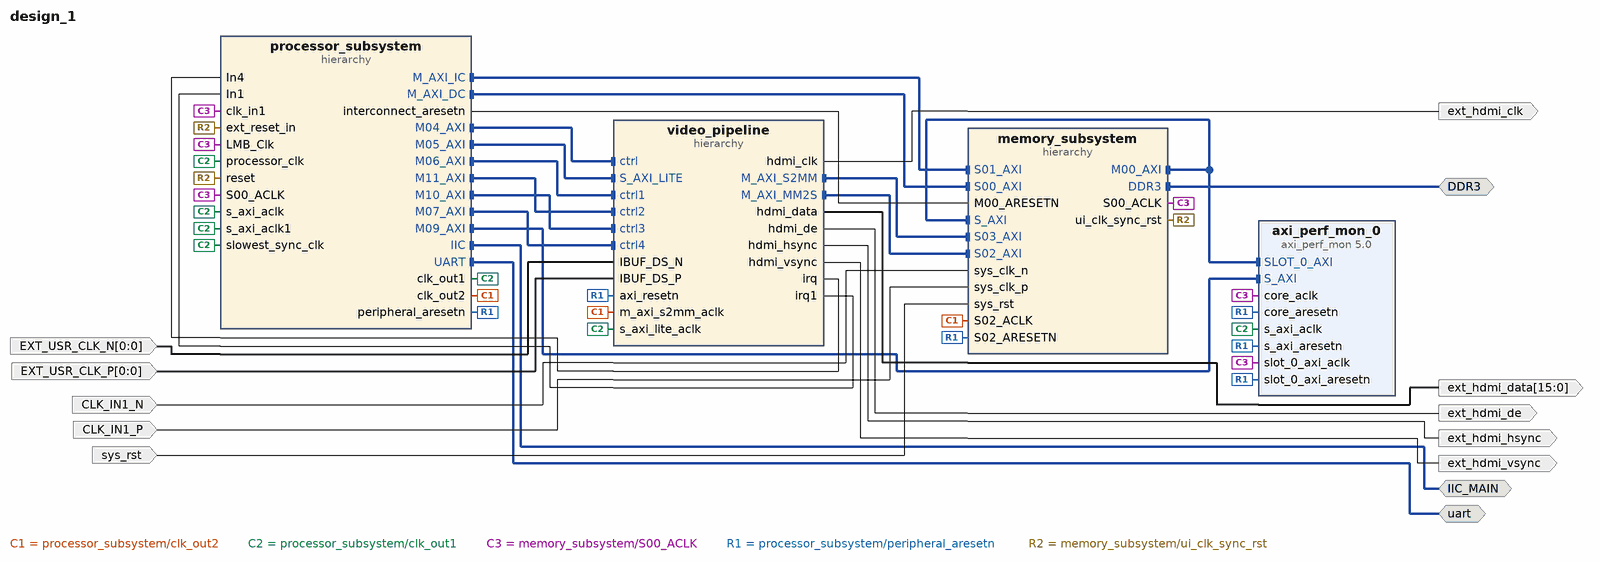
[diagram p0: block diagram of the top level]
# Vivado block design design_1, Vivado 2014.2
create_bd_design design_1

create_bd_intf_port -mode Master -vlnv xilinx.com:interface:ddrx_rtl:1.0 DDR3
create_bd_intf_port -mode Master -vlnv xilinx.com:interface:iic_rtl:1.0 IIC_MAIN
create_bd_intf_port -mode Master -vlnv xilinx.com:interface:uart_rtl:1.0 uart
create_bd_port -dir O ext_hdmi_clk
create_bd_port -dir O -from 15 -to 0 ext_hdmi_data
create_bd_port -dir O ext_hdmi_de
create_bd_port -dir O ext_hdmi_hsync
create_bd_port -dir O ext_hdmi_vsync
create_bd_port -dir I -from 0 -to 0 EXT_USR_CLK_N
create_bd_port -dir I -from 0 -to 0 EXT_USR_CLK_P
create_bd_port -dir I -type clk CLK_IN1_N
create_bd_port -dir I -type clk CLK_IN1_P
create_bd_port -dir I -type rst sys_rst
set_property -dict {CONFIG.POLARITY ACTIVE_HIGH} [get_bd_ports sys_rst]

create_bd_cell -type hier processor_subsystem
create_bd_cell -type hier video_pipeline
create_bd_cell -type hier memory_subsystem
create_bd_cell -type ip -vlnv xilinx.com:ip:axi_perf_mon:5.0 axi_perf_mon_0
set_property -dict {CONFIG.C_NUM_OF_COUNTERS 6} [get_bd_cells axi_perf_mon_0]

# ---- hierarchy /processor_subsystem ----
current_bd_instance /processor_subsystem
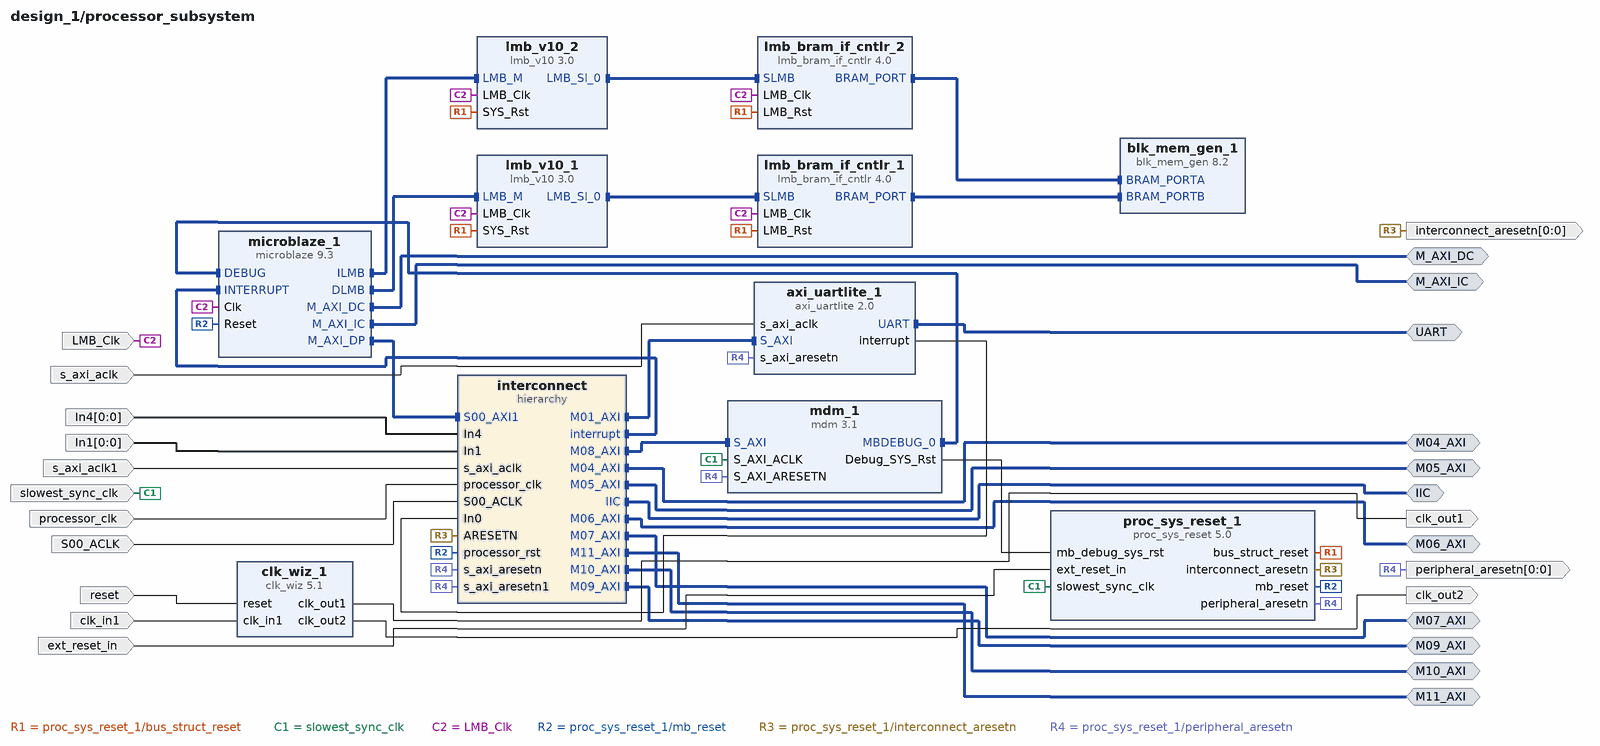
[diagram p1: block diagram inside /processor_subsystem]
create_bd_intf_pin -mode Master -vlnv xilinx.com:interface:aximm_rtl:1.0 M_AXI_DC
create_bd_intf_pin -mode Master -vlnv xilinx.com:interface:aximm_rtl:1.0 M_AXI_IC
create_bd_intf_pin -mode Master -vlnv xilinx.com:interface:uart_rtl:1.0 UART
create_bd_intf_pin -mode Master -vlnv xilinx.com:interface:aximm_rtl:1.0 M04_AXI
create_bd_intf_pin -mode Master -vlnv xilinx.com:interface:aximm_rtl:1.0 M05_AXI
create_bd_intf_pin -mode Master -vlnv xilinx.com:interface:aximm_rtl:1.0 M06_AXI
create_bd_intf_pin -mode Master -vlnv xilinx.com:interface:aximm_rtl:1.0 M11_AXI
create_bd_intf_pin -mode Master -vlnv xilinx.com:interface:aximm_rtl:1.0 M10_AXI
create_bd_intf_pin -mode Master -vlnv xilinx.com:interface:aximm_rtl:1.0 M07_AXI
create_bd_intf_pin -mode Master -vlnv xilinx.com:interface:aximm_rtl:1.0 M09_AXI
create_bd_intf_pin -mode Master -vlnv xilinx.com:interface:iic_rtl:1.0 IIC
create_bd_pin -dir I -type clk slowest_sync_clk
create_bd_pin -dir I -type clk LMB_Clk
create_bd_pin -dir I -type rst ext_reset_in
create_bd_pin -dir O -from 0 -to 0 -type rst interconnect_aresetn
create_bd_pin -dir O -from 0 -to 0 -type rst peripheral_aresetn
create_bd_pin -dir I s_axi_aclk
create_bd_pin -dir I -from 0 -to 0 In4
create_bd_pin -dir I -from 0 -to 0 In1
create_bd_pin -dir I s_axi_aclk1
create_bd_pin -dir I processor_clk
create_bd_pin -dir I S00_ACLK
create_bd_pin -dir I reset
create_bd_pin -dir I clk_in1
create_bd_pin -dir O clk_out1
create_bd_pin -dir O clk_out2

create_bd_cell -type hier interconnect
create_bd_cell -type ip -vlnv xilinx.com:ip:lmb_v10:3.0 lmb_v10_2
create_bd_cell -type ip -vlnv xilinx.com:ip:lmb_bram_if_cntlr:4.0 lmb_bram_if_cntlr_1
set_property -dict {CONFIG.C_MASK 0xc0000000} [get_bd_cells lmb_bram_if_cntlr_1]
create_bd_cell -type ip -vlnv xilinx.com:ip:lmb_v10:3.0 lmb_v10_1
create_bd_cell -type ip -vlnv xilinx.com:ip:blk_mem_gen:8.2 blk_mem_gen_1
set_property -dict [list \
  CONFIG.Memory_Type True_Dual_Port_RAM \
  CONFIG.Enable_B Use_ENB_Pin \
  CONFIG.Use_RSTB_Pin true \
  CONFIG.Port_B_Clock 100 \
  CONFIG.Port_B_Write_Rate 50 \
  CONFIG.Port_B_Enable_Rate 100 \
  CONFIG.use_bram_block BRAM_Controller \
  CONFIG.MEM_FILE design_1_blk_mem_gen_1_0.mem \
] [get_bd_cells blk_mem_gen_1]
create_bd_cell -type ip -vlnv xilinx.com:ip:microblaze:9.3 microblaze_1
set_property -dict [list \
  CONFIG.C_FREQ 100000000 \
  CONFIG.C_D_AXI 1 \
  CONFIG.C_M_AXI_DC_USER_SIGNALS 0 \
  CONFIG.C_M_AXI_IC_USER_SIGNALS 0 \
  CONFIG.C_USE_MSR_INSTR 1 \
  CONFIG.C_USE_PCMP_INSTR 1 \
  CONFIG.C_USE_BARREL 1 \
  CONFIG.C_USE_HW_MUL 1 \
  CONFIG.C_ICACHE_BASEADDR 0x80000000 \
  CONFIG.C_ICACHE_HIGHADDR 0xFFFFFFFF \
  CONFIG.C_USE_ICACHE 1 \
  CONFIG.C_CACHE_BYTE_SIZE 16384 \
  CONFIG.C_ICACHE_ALWAYS_USED 1 \
  CONFIG.C_DCACHE_BASEADDR 0x80000000 \
  CONFIG.C_DCACHE_HIGHADDR 0xFFFFFFFF \
  CONFIG.C_USE_DCACHE 1 \
  CONFIG.C_DCACHE_BYTE_SIZE 16384 \
  CONFIG.C_DCACHE_ALWAYS_USED 1 \
  CONFIG.C_USE_INTERRUPT 2 \
  CONFIG.C_USE_EXT_BRK 0 \
  CONFIG.C_USE_EXT_NM_BRK 0 \
] [get_bd_cells microblaze_1]
create_bd_cell -type ip -vlnv xilinx.com:ip:clk_wiz:5.1 clk_wiz_1
set_property -dict [list \
  CONFIG.CLKOUT2_USED true \
  CONFIG.CLKOUT3_USED true \
  CONFIG.CLKOUT4_USED true \
  CONFIG.NUM_OUT_CLKS 4 \
  CONFIG.CLKOUT1_REQUESTED_OUT_FREQ 50.000 \
  CONFIG.CLKOUT2_REQUESTED_OUT_FREQ 200.000 \
  CONFIG.CLKOUT3_REQUESTED_OUT_FREQ 150.000 \
  CONFIG.CLKOUT4_REQUESTED_OUT_FREQ 100.000 \
  CONFIG.USE_LOCKED false \
  CONFIG.CLKOUT1_JITTER 132.683 \
  CONFIG.CLKOUT1_PHASE_ERROR 87.180 \
  CONFIG.CLKOUT2_JITTER 102.086 \
  CONFIG.CLKOUT2_PHASE_ERROR 87.180 \
  CONFIG.CLKOUT3_JITTER 107.567 \
  CONFIG.CLKOUT3_PHASE_ERROR 87.180 \
  CONFIG.CLKOUT4_JITTER 115.831 \
  CONFIG.CLKOUT4_PHASE_ERROR 87.180 \
] [get_bd_cells clk_wiz_1]
create_bd_cell -type ip -vlnv xilinx.com:ip:axi_uartlite:2.0 axi_uartlite_1
set_property -dict {CONFIG.C_S_AXI_ACLK_FREQ_HZ 50000000} [get_bd_cells axi_uartlite_1]
create_bd_cell -type ip -vlnv xilinx.com:ip:proc_sys_reset:5.0 proc_sys_reset_1
set_property -dict {CONFIG.C_AUX_RESET_HIGH 0} [get_bd_cells proc_sys_reset_1]
create_bd_cell -type ip -vlnv xilinx.com:ip:mdm:3.1 mdm_1
set_property -dict {CONFIG.C_USE_UART 1} [get_bd_cells mdm_1]
create_bd_cell -type ip -vlnv xilinx.com:ip:lmb_bram_if_cntlr:4.0 lmb_bram_if_cntlr_2
set_property -dict {CONFIG.C_MASK 0x80000000} [get_bd_cells lmb_bram_if_cntlr_2]

# ---- hierarchy /processor_subsystem/interconnect ----
current_bd_instance /processor_subsystem/interconnect
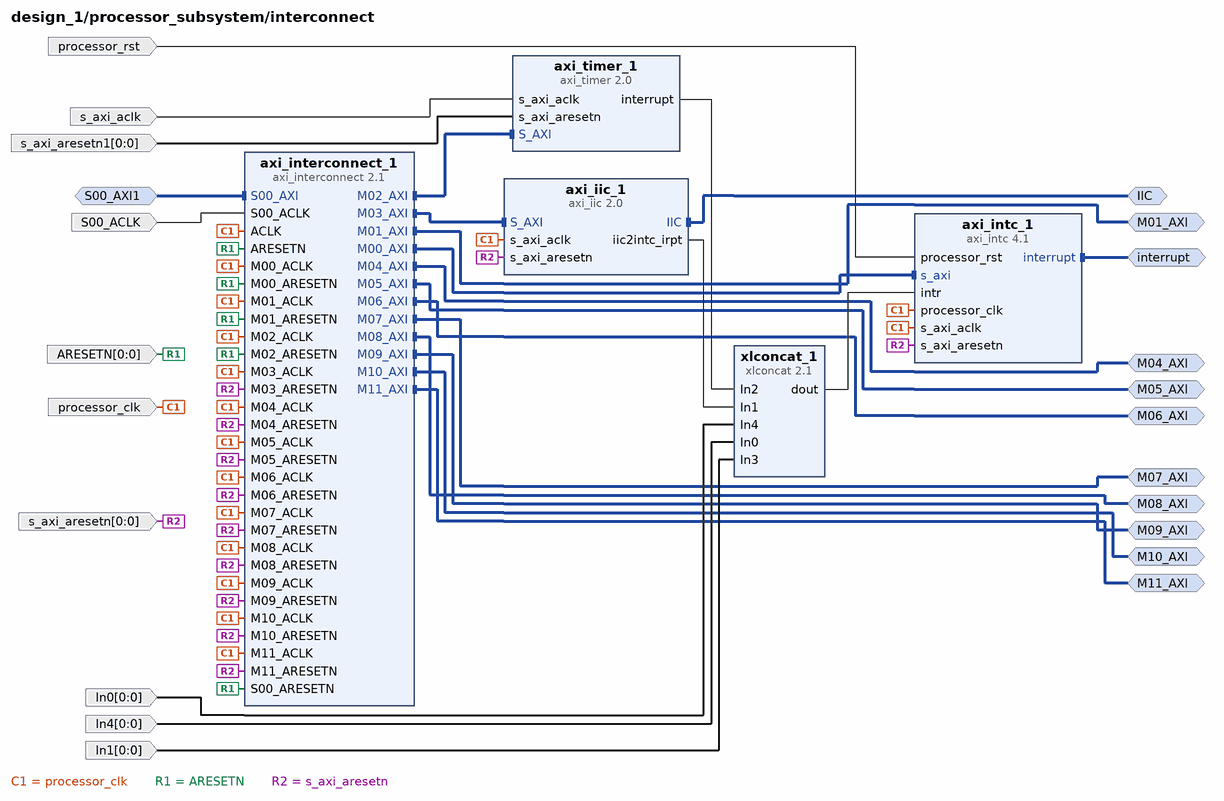
[diagram p2: block diagram inside /processor_subsystem/interconnect]
create_bd_intf_pin -mode Master -vlnv xilinx.com:interface:iic_rtl:1.0 IIC
create_bd_intf_pin -mode Master -vlnv xilinx.com:interface:mbinterrupt_rtl:1.0 interrupt
create_bd_intf_pin -mode Slave -vlnv xilinx.com:interface:aximm_rtl:1.0 S00_AXI1
create_bd_intf_pin -mode Master -vlnv xilinx.com:interface:aximm_rtl:1.0 M01_AXI
create_bd_intf_pin -mode Master -vlnv xilinx.com:interface:aximm_rtl:1.0 M04_AXI
create_bd_intf_pin -mode Master -vlnv xilinx.com:interface:aximm_rtl:1.0 M05_AXI
create_bd_intf_pin -mode Master -vlnv xilinx.com:interface:aximm_rtl:1.0 M06_AXI
create_bd_intf_pin -mode Master -vlnv xilinx.com:interface:aximm_rtl:1.0 M07_AXI
create_bd_intf_pin -mode Master -vlnv xilinx.com:interface:aximm_rtl:1.0 M08_AXI
create_bd_intf_pin -mode Master -vlnv xilinx.com:interface:aximm_rtl:1.0 M09_AXI
create_bd_intf_pin -mode Master -vlnv xilinx.com:interface:aximm_rtl:1.0 M10_AXI
create_bd_intf_pin -mode Master -vlnv xilinx.com:interface:aximm_rtl:1.0 M11_AXI
create_bd_pin -dir I -type clk processor_clk
create_bd_pin -dir I -type clk S00_ACLK
create_bd_pin -dir I -type rst processor_rst
create_bd_pin -dir I -from 0 -to 0 -type rst ARESETN
create_bd_pin -dir I -from 0 -to 0 -type rst s_axi_aresetn
create_bd_pin -dir I -from 0 -to 0 In0
create_bd_pin -dir I -from 0 -to 0 In4
create_bd_pin -dir I -from 0 -to 0 In1
create_bd_pin -dir I s_axi_aclk
create_bd_pin -dir I -from 0 -to 0 s_axi_aresetn1

create_bd_cell -type ip -vlnv xilinx.com:ip:axi_timer:2.0 axi_timer_1
create_bd_cell -type ip -vlnv xilinx.com:ip:axi_intc:4.1 axi_intc_1
set_property -dict [list \
  CONFIG.C_KIND_OF_INTR 0xFFFFFFF0 \
  CONFIG.C_ASYNC_INTR 0xFFFFFFE9 \
  CONFIG.C_HAS_FAST 1 \
  CONFIG.C_DISABLE_SYNCHRONIZERS 1 \
] [get_bd_cells axi_intc_1]
create_bd_cell -type ip -vlnv xilinx.com:ip:axi_interconnect:2.1 axi_interconnect_1
set_property -dict {CONFIG.NUM_MI 12} [get_bd_cells axi_interconnect_1]
create_bd_cell -type ip -vlnv xilinx.com:ip:axi_iic:2.0 axi_iic_1
set_property -dict {CONFIG.C_GPO_WIDTH 3 CONFIG.USE_BOARD_FLOW true CONFIG.IIC_BOARD_INTERFACE iic_main} [get_bd_cells axi_iic_1]
create_bd_cell -type ip -vlnv xilinx.com:ip:xlconcat:2.1 xlconcat_1
set_property -dict {CONFIG.NUM_PORTS 5} [get_bd_cells xlconcat_1]

# ---- hierarchy /video_pipeline ----
current_bd_instance /video_pipeline
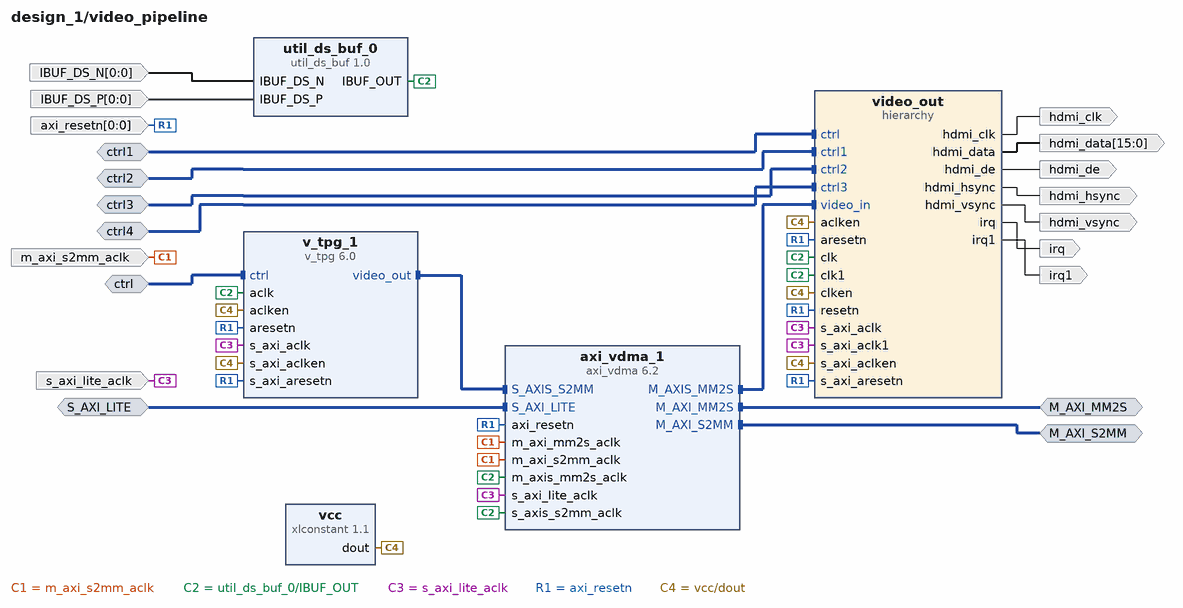
[diagram p3: block diagram inside /video_pipeline]
create_bd_intf_pin -mode Slave -vlnv xilinx.com:interface:aximm_rtl:1.0 ctrl
create_bd_intf_pin -mode Slave -vlnv xilinx.com:interface:aximm_rtl:1.0 S_AXI_LITE
create_bd_intf_pin -mode Master -vlnv xilinx.com:interface:aximm_rtl:1.0 M_AXI_MM2S
create_bd_intf_pin -mode Master -vlnv xilinx.com:interface:aximm_rtl:1.0 M_AXI_S2MM
create_bd_intf_pin -mode Slave -vlnv xilinx.com:interface:aximm_rtl:1.0 ctrl1
create_bd_intf_pin -mode Slave -vlnv xilinx.com:interface:aximm_rtl:1.0 ctrl2
create_bd_intf_pin -mode Slave -vlnv xilinx.com:interface:aximm_rtl:1.0 ctrl3
create_bd_intf_pin -mode Slave -vlnv xilinx.com:interface:aximm_rtl:1.0 ctrl4
create_bd_pin -dir O -type intr irq
create_bd_pin -dir O irq1
create_bd_pin -dir I -type clk m_axi_s2mm_aclk
create_bd_pin -dir O hdmi_clk
create_bd_pin -dir O -from 15 -to 0 hdmi_data
create_bd_pin -dir O hdmi_de
create_bd_pin -dir O hdmi_hsync
create_bd_pin -dir O hdmi_vsync
create_bd_pin -dir I -type clk s_axi_lite_aclk
create_bd_pin -dir I -from 0 -to 0 -type rst axi_resetn
create_bd_pin -dir I -from 0 -to 0 IBUF_DS_N
create_bd_pin -dir I -from 0 -to 0 IBUF_DS_P

create_bd_cell -type hier video_out
create_bd_cell -type ip -vlnv xilinx.com:ip:axi_vdma:6.2 axi_vdma_1
set_property -dict [list \
  CONFIG.c_m_axi_mm2s_data_width 32 \
  CONFIG.c_m_axis_mm2s_tdata_width 24 \
  CONFIG.c_m_axi_s2mm_data_width 32 \
  CONFIG.c_use_mm2s_fsync 0 \
  CONFIG.c_use_s2mm_fsync 0 \
  CONFIG.c_mm2s_genlock_mode 3 \
  CONFIG.c_s2mm_genlock_mode 2 \
  CONFIG.c_mm2s_linebuffer_depth 1024 \
  CONFIG.c_s2mm_linebuffer_depth 1024 \
  CONFIG.c_mm2s_max_burst_length 256 \
  CONFIG.c_s2mm_max_burst_length 256 \
  CONFIG.c_enable_debug_info_6 0 \
  CONFIG.c_enable_debug_info_7 0 \
  CONFIG.c_enable_debug_info_14 0 \
  CONFIG.c_enable_debug_info_15 0 \
] [get_bd_cells axi_vdma_1]
create_bd_cell -type ip -vlnv xilinx.com:ip:v_tpg:6.0 v_tpg_1
set_property -dict {CONFIG.has_axi4s_slave false CONFIG.pattern_control 11 CONFIG.m_video_format 2} [get_bd_cells v_tpg_1]
create_bd_cell -type ip -vlnv xilinx.com:ip:xlconstant:1.1 vcc
create_bd_cell -type ip -vlnv xilinx.com:ip:util_ds_buf:1.0 util_ds_buf_0

# ---- hierarchy /video_pipeline/video_out ----
current_bd_instance /video_pipeline/video_out
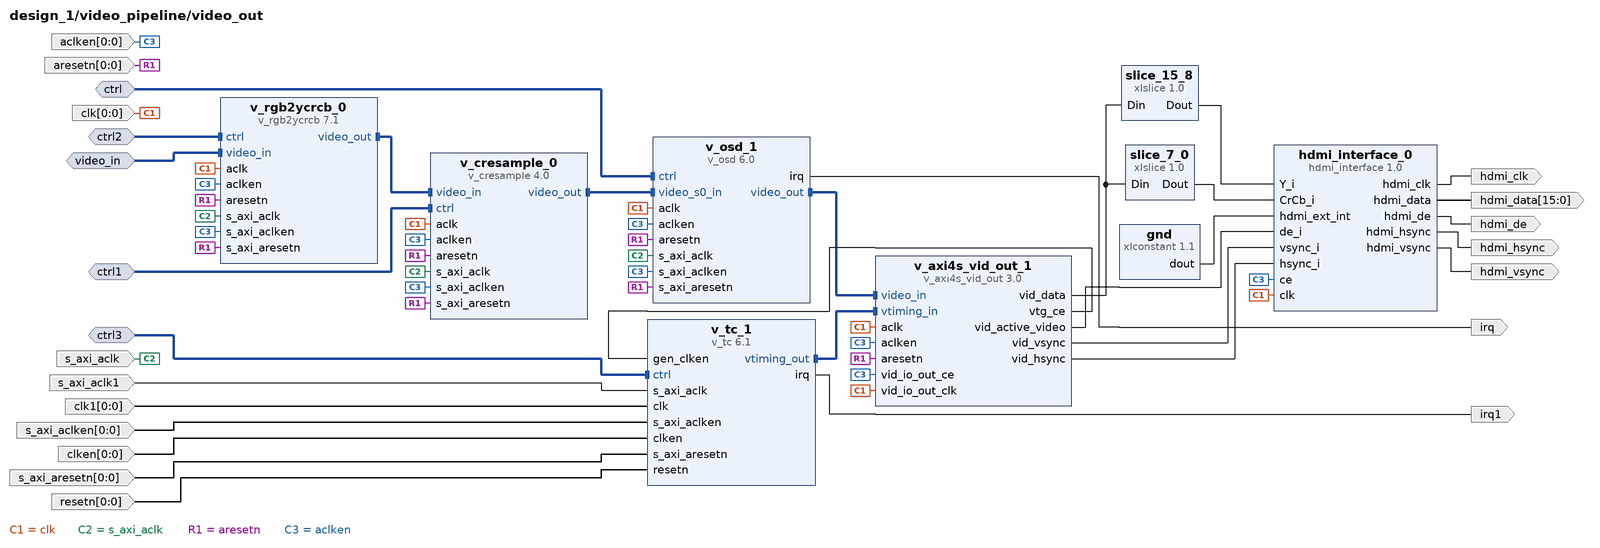
[diagram p4: block diagram inside /video_pipeline/video_out]
create_bd_intf_pin -mode Slave -vlnv xilinx.com:interface:aximm_rtl:1.0 ctrl
create_bd_intf_pin -mode Slave -vlnv xilinx.com:interface:aximm_rtl:1.0 ctrl1
create_bd_intf_pin -mode Slave -vlnv xilinx.com:interface:aximm_rtl:1.0 ctrl2
create_bd_intf_pin -mode Slave -vlnv xilinx.com:interface:axis_rtl:1.0 video_in
create_bd_intf_pin -mode Slave -vlnv xilinx.com:interface:aximm_rtl:1.0 ctrl3
create_bd_pin -dir I -from 0 -to 0 clk
create_bd_pin -dir O hdmi_clk
create_bd_pin -dir O -from 15 -to 0 hdmi_data
create_bd_pin -dir O hdmi_de
create_bd_pin -dir O hdmi_hsync
create_bd_pin -dir O hdmi_vsync
create_bd_pin -dir I -type clk s_axi_aclk
create_bd_pin -dir I -from 0 -to 0 -type rst aresetn
create_bd_pin -dir I -from 0 -to 0 -type ce aclken
create_bd_pin -dir O -type intr irq
create_bd_pin -dir I s_axi_aclk1
create_bd_pin -dir I -from 0 -to 0 clk1
create_bd_pin -dir O irq1
create_bd_pin -dir I -from 0 -to 0 s_axi_aclken
create_bd_pin -dir I -from 0 -to 0 clken
create_bd_pin -dir I -from 0 -to 0 s_axi_aresetn
create_bd_pin -dir I -from 0 -to 0 resetn

create_bd_cell -type ip -vlnv xilinx.com:ip:xlslice:1.0 slice_15_8
set_property -dict {CONFIG.DIN_TO 8 CONFIG.DIN_FROM 15 CONFIG.DIN_WIDTH 16} [get_bd_cells slice_15_8]
create_bd_cell -type ip -vlnv xilinx.com:ip:hdmi_interface:1.0 hdmi_interface_0
create_bd_cell -type ip -vlnv xilinx.com:ip:xlslice:1.0 slice_7_0
set_property -dict {CONFIG.DIN_FROM 7 CONFIG.DIN_WIDTH 16} [get_bd_cells slice_7_0]
create_bd_cell -type ip -vlnv xilinx.com:ip:v_tc:6.1 v_tc_1
set_property -dict [list \
  CONFIG.HAS_INTC_IF false \
  CONFIG.max_clocks_per_line 8192 \
  CONFIG.max_lines_per_frame 8192 \
  CONFIG.VIDEO_MODE 1080p \
  CONFIG.horizontal_sync_generation true \
  CONFIG.enable_detection false \
  CONFIG.vertical_blank_generation true \
  CONFIG.enable_generation true \
  CONFIG.vertical_sync_generation true \
  CONFIG.active_chroma_generation false \
  CONFIG.active_video_generation true \
  CONFIG.horizontal_blank_generation true \
] [get_bd_cells v_tc_1]
create_bd_cell -type ip -vlnv xilinx.com:ip:v_axi4s_vid_out:3.0 v_axi4s_vid_out_1
set_property -dict [list \
  CONFIG.C_S_AXIS_VIDEO_FORMAT 0 \
  CONFIG.RAM_ADDR_BITS 13 \
  CONFIG.HYSTERESIS_LEVEL 12 \
  CONFIG.VTG_MASTER_SLAVE 0 \
] [get_bd_cells v_axi4s_vid_out_1]
create_bd_cell -type ip -vlnv xilinx.com:ip:v_cresample:4.0 v_cresample_0
set_property -dict [list \
  CONFIG.has_axi4_lite true \
  CONFIG.s_axis_video_format 3 \
  CONFIG.m_axis_video_format 2 \
] [get_bd_cells v_cresample_0]
create_bd_cell -type ip -vlnv xilinx.com:ip:v_osd:6.0 v_osd_1
set_property -dict [list \
  CONFIG.SCREEN_WIDTH 1920 \
  CONFIG.M_AXIS_VIDEO_WIDTH 1920 \
  CONFIG.M_AXIS_VIDEO_HEIGHT 1080 \
  CONFIG.LAYER0_WIDTH 1920 \
  CONFIG.LAYER0_HEIGHT 1080 \
] [get_bd_cells v_osd_1]
create_bd_cell -type ip -vlnv xilinx.com:ip:v_rgb2ycrcb:7.1 v_rgb2ycrcb_0
set_property -dict {CONFIG.HAS_AXI4_LITE true} [get_bd_cells v_rgb2ycrcb_0]
create_bd_cell -type ip -vlnv xilinx.com:ip:xlconstant:1.1 gnd
set_property -dict {CONFIG.CONST_VAL 0} [get_bd_cells gnd]

# ---- hierarchy /memory_subsystem ----
current_bd_instance /memory_subsystem
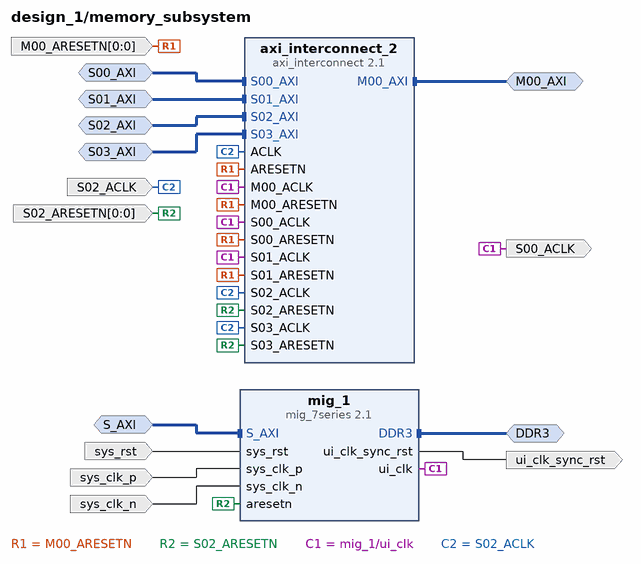
[diagram p5: block diagram inside /memory_subsystem]
create_bd_intf_pin -mode Master -vlnv xilinx.com:interface:ddrx_rtl:1.0 DDR3
create_bd_intf_pin -mode Master -vlnv xilinx.com:interface:aximm_rtl:1.0 M00_AXI
create_bd_intf_pin -mode Slave -vlnv xilinx.com:interface:aximm_rtl:1.0 S_AXI
create_bd_intf_pin -mode Slave -vlnv xilinx.com:interface:aximm_rtl:1.0 S00_AXI
create_bd_intf_pin -mode Slave -vlnv xilinx.com:interface:aximm_rtl:1.0 S01_AXI
create_bd_intf_pin -mode Slave -vlnv xilinx.com:interface:aximm_rtl:1.0 S02_AXI
create_bd_intf_pin -mode Slave -vlnv xilinx.com:interface:aximm_rtl:1.0 S03_AXI
create_bd_pin -dir I -from 0 -to 0 -type rst M00_ARESETN
create_bd_pin -dir I -from 0 -to 0 -type rst S02_ARESETN
create_bd_pin -dir O -type clk S00_ACLK
create_bd_pin -dir I -type clk S02_ACLK
create_bd_pin -dir I -type rst sys_rst
create_bd_pin -dir O -type rst ui_clk_sync_rst
create_bd_pin -dir I sys_clk_p
create_bd_pin -dir I sys_clk_n

create_bd_cell -type ip -vlnv xilinx.com:ip:axi_interconnect:2.1 axi_interconnect_2
set_property -dict [list \
  CONFIG.NUM_SI 4 \
  CONFIG.NUM_MI 1 \
  CONFIG.STRATEGY 2 \
  CONFIG.ENABLE_ADVANCED_OPTIONS 1 \
  CONFIG.XBAR_DATA_WIDTH 512 \
  CONFIG.M00_HAS_REGSLICE 1 \
  CONFIG.M00_HAS_DATA_FIFO 2 \
  CONFIG.M02_HAS_DATA_FIFO 2 \
  CONFIG.S00_HAS_REGSLICE 1 \
  CONFIG.S01_HAS_REGSLICE 1 \
  CONFIG.S02_HAS_REGSLICE 1 \
  CONFIG.S03_HAS_REGSLICE 1 \
] [get_bd_cells axi_interconnect_2]
create_bd_cell -type ip -vlnv xilinx.com:ip:mig_7series:2.1 mig_1
set_property -dict {CONFIG.XML_INPUT_FILE mig_a.prj CONFIG.RESET_BOARD_INTERFACE Custom} [get_bd_cells mig_1]

# ---- connections ----

current_bd_instance /processor_subsystem
connect_bd_intf_net [get_bd_intf_pins lmb_bram_if_cntlr_1/SLMB] [get_bd_intf_pins lmb_v10_1/LMB_Sl_0]
connect_bd_intf_net [get_bd_intf_pins blk_mem_gen_1/BRAM_PORTB] [get_bd_intf_pins lmb_bram_if_cntlr_1/BRAM_PORT]
connect_bd_intf_net [get_bd_intf_pins lmb_bram_if_cntlr_2/SLMB] [get_bd_intf_pins lmb_v10_2/LMB_Sl_0]
connect_bd_intf_net [get_bd_intf_pins blk_mem_gen_1/BRAM_PORTA] [get_bd_intf_pins lmb_bram_if_cntlr_2/BRAM_PORT]
connect_bd_intf_net [get_bd_intf_pins lmb_v10_2/LMB_M] [get_bd_intf_pins microblaze_1/ILMB]
connect_bd_intf_net [get_bd_intf_pins mdm_1/MBDEBUG_0] [get_bd_intf_pins microblaze_1/DEBUG]
connect_bd_intf_net [get_bd_intf_pins lmb_v10_1/LMB_M] [get_bd_intf_pins microblaze_1/DLMB]
connect_bd_intf_net [get_bd_intf_pins axi_uartlite_1/S_AXI] [get_bd_intf_pins interconnect/M01_AXI]
connect_bd_intf_net [get_bd_intf_pins mdm_1/S_AXI] [get_bd_intf_pins interconnect/M08_AXI]
connect_bd_intf_net [get_bd_intf_pins microblaze_1/M_AXI_DP] [get_bd_intf_pins interconnect/S00_AXI1]
connect_bd_intf_net [get_bd_intf_pins microblaze_1/INTERRUPT] [get_bd_intf_pins interconnect/interrupt]
connect_bd_intf_net [get_bd_intf_pins M_AXI_DC] [get_bd_intf_pins microblaze_1/M_AXI_DC]
connect_bd_intf_net [get_bd_intf_pins M_AXI_IC] [get_bd_intf_pins microblaze_1/M_AXI_IC]
connect_bd_intf_net [get_bd_intf_pins UART] [get_bd_intf_pins axi_uartlite_1/UART]
connect_bd_intf_net [get_bd_intf_pins M04_AXI] [get_bd_intf_pins interconnect/M04_AXI]
connect_bd_intf_net [get_bd_intf_pins M05_AXI] [get_bd_intf_pins interconnect/M05_AXI]
connect_bd_intf_net [get_bd_intf_pins M06_AXI] [get_bd_intf_pins interconnect/M06_AXI]
connect_bd_intf_net [get_bd_intf_pins M11_AXI] [get_bd_intf_pins interconnect/M11_AXI]
connect_bd_intf_net [get_bd_intf_pins M10_AXI] [get_bd_intf_pins interconnect/M10_AXI]
connect_bd_intf_net [get_bd_intf_pins M07_AXI] [get_bd_intf_pins interconnect/M07_AXI]
connect_bd_intf_net [get_bd_intf_pins M09_AXI] [get_bd_intf_pins interconnect/M09_AXI]
connect_bd_intf_net [get_bd_intf_pins IIC] [get_bd_intf_pins interconnect/IIC]
connect_bd_net [get_bd_pins proc_sys_reset_1/bus_struct_reset] \
  [get_bd_pins lmb_v10_2/SYS_Rst] [get_bd_pins lmb_bram_if_cntlr_1/LMB_Rst] [get_bd_pins lmb_v10_1/SYS_Rst] \
  [get_bd_pins lmb_bram_if_cntlr_2/LMB_Rst]
connect_bd_net [get_bd_pins mdm_1/Debug_SYS_Rst] [get_bd_pins proc_sys_reset_1/mb_debug_sys_rst]
connect_bd_net -net mig_1_ui_clk [get_bd_pins slowest_sync_clk] [get_bd_pins proc_sys_reset_1/slowest_sync_clk] [get_bd_pins mdm_1/S_AXI_ACLK]
connect_bd_net -net mig_1_ui_clk1 [get_bd_pins LMB_Clk] \
  [get_bd_pins lmb_v10_2/LMB_Clk] [get_bd_pins lmb_bram_if_cntlr_1/LMB_Clk] [get_bd_pins lmb_v10_1/LMB_Clk] \
  [get_bd_pins microblaze_1/Clk] [get_bd_pins lmb_bram_if_cntlr_2/LMB_Clk]
connect_bd_net -net mig_1_ui_clk_sync_rst [get_bd_pins ext_reset_in] [get_bd_pins proc_sys_reset_1/ext_reset_in]
connect_bd_net [get_bd_pins proc_sys_reset_1/mb_reset] [get_bd_pins interconnect/processor_rst] [get_bd_pins microblaze_1/Reset]
connect_bd_net [get_bd_pins proc_sys_reset_1/interconnect_aresetn] [get_bd_pins interconnect_aresetn] [get_bd_pins interconnect/ARESETN]
connect_bd_net [get_bd_pins proc_sys_reset_1/peripheral_aresetn] \
  [get_bd_pins peripheral_aresetn] [get_bd_pins interconnect/s_axi_aresetn] [get_bd_pins interconnect/s_axi_aresetn1] \
  [get_bd_pins axi_uartlite_1/s_axi_aresetn] [get_bd_pins mdm_1/S_AXI_ARESETN]
connect_bd_net [get_bd_pins s_axi_aclk] [get_bd_pins axi_uartlite_1/s_axi_aclk]
connect_bd_net -net In4_1 [get_bd_pins In4] [get_bd_pins interconnect/In4]
connect_bd_net -net In1_1 [get_bd_pins In1] [get_bd_pins interconnect/In1]
connect_bd_net [get_bd_pins axi_uartlite_1/interrupt] [get_bd_pins interconnect/In0]
connect_bd_net [get_bd_pins s_axi_aclk1] [get_bd_pins interconnect/s_axi_aclk]
connect_bd_net [get_bd_pins processor_clk] [get_bd_pins interconnect/processor_clk]
connect_bd_net [get_bd_pins S00_ACLK] [get_bd_pins interconnect/S00_ACLK]
connect_bd_net [get_bd_pins reset] [get_bd_pins clk_wiz_1/reset]
connect_bd_net -net clk_in1_1 [get_bd_pins clk_in1] [get_bd_pins clk_wiz_1/clk_in1]
connect_bd_net [get_bd_pins clk_wiz_1/clk_out1] [get_bd_pins clk_out1]
connect_bd_net [get_bd_pins clk_wiz_1/clk_out2] [get_bd_pins clk_out2]

current_bd_instance /processor_subsystem/interconnect
connect_bd_intf_net [get_bd_intf_pins axi_iic_1/S_AXI] [get_bd_intf_pins axi_interconnect_1/M03_AXI]
connect_bd_intf_net [get_bd_intf_pins axi_intc_1/s_axi] [get_bd_intf_pins axi_interconnect_1/M00_AXI]
connect_bd_intf_net [get_bd_intf_pins axi_interconnect_1/M02_AXI] [get_bd_intf_pins axi_timer_1/S_AXI]
connect_bd_intf_net [get_bd_intf_pins IIC] [get_bd_intf_pins axi_iic_1/IIC]
connect_bd_intf_net [get_bd_intf_pins interrupt] [get_bd_intf_pins axi_intc_1/interrupt]
connect_bd_intf_net -intf_net microblaze_1_m_axi_dp [get_bd_intf_pins S00_AXI1] [get_bd_intf_pins axi_interconnect_1/S00_AXI]
connect_bd_intf_net [get_bd_intf_pins M01_AXI] [get_bd_intf_pins axi_interconnect_1/M01_AXI]
connect_bd_intf_net [get_bd_intf_pins M04_AXI] [get_bd_intf_pins axi_interconnect_1/M04_AXI]
connect_bd_intf_net [get_bd_intf_pins M05_AXI] [get_bd_intf_pins axi_interconnect_1/M05_AXI]
connect_bd_intf_net [get_bd_intf_pins M06_AXI] [get_bd_intf_pins axi_interconnect_1/M06_AXI]
connect_bd_intf_net [get_bd_intf_pins M07_AXI] [get_bd_intf_pins axi_interconnect_1/M07_AXI]
connect_bd_intf_net [get_bd_intf_pins M08_AXI] [get_bd_intf_pins axi_interconnect_1/M08_AXI]
connect_bd_intf_net [get_bd_intf_pins M09_AXI] [get_bd_intf_pins axi_interconnect_1/M09_AXI]
connect_bd_intf_net [get_bd_intf_pins M10_AXI] [get_bd_intf_pins axi_interconnect_1/M10_AXI]
connect_bd_intf_net [get_bd_intf_pins M11_AXI] [get_bd_intf_pins axi_interconnect_1/M11_AXI]
connect_bd_net -net mig_1_ui_clk [get_bd_pins processor_clk] \
  [get_bd_pins axi_intc_1/s_axi_aclk] [get_bd_pins axi_intc_1/processor_clk] [get_bd_pins axi_interconnect_1/ACLK] \
  [get_bd_pins axi_interconnect_1/M00_ACLK] [get_bd_pins axi_interconnect_1/M01_ACLK] \
  [get_bd_pins axi_interconnect_1/M02_ACLK] [get_bd_pins axi_interconnect_1/M03_ACLK] \
  [get_bd_pins axi_interconnect_1/M04_ACLK] [get_bd_pins axi_interconnect_1/M05_ACLK] \
  [get_bd_pins axi_interconnect_1/M06_ACLK] [get_bd_pins axi_interconnect_1/M07_ACLK] \
  [get_bd_pins axi_interconnect_1/M08_ACLK] [get_bd_pins axi_interconnect_1/M09_ACLK] \
  [get_bd_pins axi_interconnect_1/M10_ACLK] [get_bd_pins axi_interconnect_1/M11_ACLK] [get_bd_pins axi_iic_1/s_axi_aclk]
connect_bd_net -net mig_1_ui_clk1 [get_bd_pins S00_ACLK] [get_bd_pins axi_interconnect_1/S00_ACLK]
connect_bd_net -net proc_sys_reset_1_mb_reset [get_bd_pins processor_rst] [get_bd_pins axi_intc_1/processor_rst]
connect_bd_net -net proc_sys_reset_1_interconnect_aresetn [get_bd_pins ARESETN] \
  [get_bd_pins axi_interconnect_1/ARESETN] [get_bd_pins axi_interconnect_1/S00_ARESETN] \
  [get_bd_pins axi_interconnect_1/M00_ARESETN] [get_bd_pins axi_interconnect_1/M01_ARESETN] \
  [get_bd_pins axi_interconnect_1/M02_ARESETN]
connect_bd_net -net proc_sys_reset_1_peripheral_aresetn [get_bd_pins s_axi_aresetn] \
  [get_bd_pins axi_intc_1/s_axi_aresetn] [get_bd_pins axi_interconnect_1/M03_ARESETN] \
  [get_bd_pins axi_interconnect_1/M04_ARESETN] [get_bd_pins axi_interconnect_1/M05_ARESETN] \
  [get_bd_pins axi_interconnect_1/M06_ARESETN] [get_bd_pins axi_interconnect_1/M07_ARESETN] \
  [get_bd_pins axi_interconnect_1/M08_ARESETN] [get_bd_pins axi_interconnect_1/M09_ARESETN] \
  [get_bd_pins axi_interconnect_1/M10_ARESETN] [get_bd_pins axi_interconnect_1/M11_ARESETN] \
  [get_bd_pins axi_iic_1/s_axi_aresetn]
connect_bd_net [get_bd_pins axi_iic_1/iic2intc_irpt] [get_bd_pins xlconcat_1/In1]
connect_bd_net [get_bd_pins xlconcat_1/dout] [get_bd_pins axi_intc_1/intr]
connect_bd_net -net In0_1 [get_bd_pins In0] [get_bd_pins xlconcat_1/In4]
connect_bd_net -net In4_1 [get_bd_pins In4] [get_bd_pins xlconcat_1/In0]
connect_bd_net -net In1_1 [get_bd_pins In1] [get_bd_pins xlconcat_1/In3]
connect_bd_net [get_bd_pins s_axi_aclk] [get_bd_pins axi_timer_1/s_axi_aclk]
connect_bd_net [get_bd_pins axi_timer_1/interrupt] [get_bd_pins xlconcat_1/In2]
connect_bd_net -net s_axi_aresetn1_1 [get_bd_pins s_axi_aresetn1] [get_bd_pins axi_timer_1/s_axi_aresetn]

current_bd_instance /video_pipeline
connect_bd_intf_net [get_bd_intf_pins axi_vdma_1/S_AXIS_S2MM] [get_bd_intf_pins v_tpg_1/video_out]
connect_bd_intf_net [get_bd_intf_pins axi_vdma_1/M_AXIS_MM2S] [get_bd_intf_pins video_out/video_in]
connect_bd_intf_net -intf_net axi_interconnect_1_m04_axi [get_bd_intf_pins ctrl] [get_bd_intf_pins v_tpg_1/ctrl]
connect_bd_intf_net -intf_net axi_interconnect_1_m05_axi [get_bd_intf_pins S_AXI_LITE] [get_bd_intf_pins axi_vdma_1/S_AXI_LITE]
connect_bd_intf_net [get_bd_intf_pins M_AXI_MM2S] [get_bd_intf_pins axi_vdma_1/M_AXI_MM2S]
connect_bd_intf_net [get_bd_intf_pins M_AXI_S2MM] [get_bd_intf_pins axi_vdma_1/M_AXI_S2MM]
connect_bd_intf_net -intf_net axi_interconnect_1_m06_axi [get_bd_intf_pins ctrl1] [get_bd_intf_pins video_out/ctrl]
connect_bd_intf_net -intf_net axi_interconnect_1_m11_axi [get_bd_intf_pins ctrl2] [get_bd_intf_pins video_out/ctrl1]
connect_bd_intf_net -intf_net axi_interconnect_1_m10_axi [get_bd_intf_pins ctrl3] [get_bd_intf_pins video_out/ctrl2]
connect_bd_intf_net -intf_net interconnect_M07_AXI [get_bd_intf_pins ctrl4] [get_bd_intf_pins video_out/ctrl3]
connect_bd_net [get_bd_pins video_out/irq] [get_bd_pins irq]
connect_bd_net [get_bd_pins video_out/irq1] [get_bd_pins irq1]
connect_bd_net -net clk_wiz_1_clk_out2 [get_bd_pins m_axi_s2mm_aclk] [get_bd_pins axi_vdma_1/m_axi_mm2s_aclk] [get_bd_pins axi_vdma_1/m_axi_s2mm_aclk]
connect_bd_net -net clk_wiz_1_clk_out3 [get_bd_pins util_ds_buf_0/IBUF_OUT] \
  [get_bd_pins video_out/clk] [get_bd_pins video_out/clk1] [get_bd_pins axi_vdma_1/m_axis_mm2s_aclk] \
  [get_bd_pins axi_vdma_1/s_axis_s2mm_aclk] [get_bd_pins v_tpg_1/aclk]
connect_bd_net -net hdmi_interface_0_hdmi_clk [get_bd_pins video_out/hdmi_clk] [get_bd_pins hdmi_clk]
connect_bd_net -net hdmi_interface_0_hdmi_data [get_bd_pins video_out/hdmi_data] [get_bd_pins hdmi_data]
connect_bd_net -net hdmi_interface_0_hdmi_de [get_bd_pins video_out/hdmi_de] [get_bd_pins hdmi_de]
connect_bd_net -net hdmi_interface_0_hdmi_hsync [get_bd_pins video_out/hdmi_hsync] [get_bd_pins hdmi_hsync]
connect_bd_net -net hdmi_interface_0_hdmi_vsync [get_bd_pins video_out/hdmi_vsync] [get_bd_pins hdmi_vsync]
connect_bd_net -net mig_1_ui_clk [get_bd_pins s_axi_lite_aclk] \
  [get_bd_pins video_out/s_axi_aclk] [get_bd_pins video_out/s_axi_aclk1] [get_bd_pins axi_vdma_1/s_axi_lite_aclk] \
  [get_bd_pins v_tpg_1/s_axi_aclk]
connect_bd_net -net proc_sys_reset_1_peripheral_aresetn [get_bd_pins axi_resetn] \
  [get_bd_pins video_out/aresetn] [get_bd_pins video_out/s_axi_aresetn] [get_bd_pins video_out/resetn] \
  [get_bd_pins axi_vdma_1/axi_resetn] [get_bd_pins v_tpg_1/aresetn] [get_bd_pins v_tpg_1/s_axi_aresetn]
connect_bd_net -net vcc_const [get_bd_pins vcc/dout] \
  [get_bd_pins video_out/aclken] [get_bd_pins video_out/s_axi_aclken] [get_bd_pins video_out/clken] \
  [get_bd_pins v_tpg_1/aclken] [get_bd_pins v_tpg_1/s_axi_aclken]
connect_bd_net [get_bd_pins IBUF_DS_N] [get_bd_pins util_ds_buf_0/IBUF_DS_N]
connect_bd_net [get_bd_pins IBUF_DS_P] [get_bd_pins util_ds_buf_0/IBUF_DS_P]

current_bd_instance /video_pipeline/video_out
connect_bd_intf_net [get_bd_intf_pins v_cresample_0/video_out] [get_bd_intf_pins v_osd_1/video_s0_in]
connect_bd_intf_net [get_bd_intf_pins v_axi4s_vid_out_1/video_in] [get_bd_intf_pins v_osd_1/video_out]
connect_bd_intf_net [get_bd_intf_pins v_cresample_0/video_in] [get_bd_intf_pins v_rgb2ycrcb_0/video_out]
connect_bd_intf_net [get_bd_intf_pins v_axi4s_vid_out_1/vtiming_in] [get_bd_intf_pins v_tc_1/vtiming_out]
connect_bd_intf_net -intf_net axi_interconnect_1_m06_axi [get_bd_intf_pins ctrl] [get_bd_intf_pins v_osd_1/ctrl]
connect_bd_intf_net -intf_net axi_interconnect_1_m11_axi [get_bd_intf_pins ctrl1] [get_bd_intf_pins v_cresample_0/ctrl]
connect_bd_intf_net -intf_net axi_interconnect_1_m10_axi [get_bd_intf_pins ctrl2] [get_bd_intf_pins v_rgb2ycrcb_0/ctrl]
connect_bd_intf_net -intf_net axi_vdma_1_m_axis_mm2s [get_bd_intf_pins video_in] [get_bd_intf_pins v_rgb2ycrcb_0/video_in]
connect_bd_intf_net [get_bd_intf_pins ctrl3] [get_bd_intf_pins v_tc_1/ctrl]
connect_bd_net [get_bd_pins slice_15_8/Dout] [get_bd_pins hdmi_interface_0/Y_i]
connect_bd_net [get_bd_pins v_axi4s_vid_out_1/vid_active_video] [get_bd_pins hdmi_interface_0/de_i]
connect_bd_net [get_bd_pins v_axi4s_vid_out_1/vid_vsync] [get_bd_pins hdmi_interface_0/vsync_i]
connect_bd_net [get_bd_pins v_axi4s_vid_out_1/vid_hsync] [get_bd_pins hdmi_interface_0/hsync_i]
connect_bd_net -net clk_wiz_1_clk_out3 [get_bd_pins clk] \
  [get_bd_pins hdmi_interface_0/clk] [get_bd_pins v_axi4s_vid_out_1/aclk] [get_bd_pins v_axi4s_vid_out_1/vid_io_out_clk] \
  [get_bd_pins v_cresample_0/aclk] [get_bd_pins v_osd_1/aclk] [get_bd_pins v_rgb2ycrcb_0/aclk]
connect_bd_net [get_bd_pins hdmi_interface_0/hdmi_clk] [get_bd_pins hdmi_clk]
connect_bd_net [get_bd_pins hdmi_interface_0/hdmi_data] [get_bd_pins hdmi_data]
connect_bd_net [get_bd_pins hdmi_interface_0/hdmi_de] [get_bd_pins hdmi_de]
connect_bd_net [get_bd_pins hdmi_interface_0/hdmi_hsync] [get_bd_pins hdmi_hsync]
connect_bd_net [get_bd_pins hdmi_interface_0/hdmi_vsync] [get_bd_pins hdmi_vsync]
connect_bd_net -net mig_1_ui_clk [get_bd_pins s_axi_aclk] \
  [get_bd_pins v_cresample_0/s_axi_aclk] [get_bd_pins v_osd_1/s_axi_aclk] [get_bd_pins v_rgb2ycrcb_0/s_axi_aclk]
connect_bd_net -net proc_sys_reset_1_peripheral_aresetn [get_bd_pins aresetn] \
  [get_bd_pins v_axi4s_vid_out_1/aresetn] [get_bd_pins v_cresample_0/aresetn] [get_bd_pins v_cresample_0/s_axi_aresetn] \
  [get_bd_pins v_osd_1/aresetn] [get_bd_pins v_osd_1/s_axi_aresetn] [get_bd_pins v_rgb2ycrcb_0/aresetn] \
  [get_bd_pins v_rgb2ycrcb_0/s_axi_aresetn]
connect_bd_net -net vcc_const [get_bd_pins aclken] \
  [get_bd_pins hdmi_interface_0/ce] [get_bd_pins v_axi4s_vid_out_1/aclken] [get_bd_pins v_axi4s_vid_out_1/vid_io_out_ce] \
  [get_bd_pins v_cresample_0/aclken] [get_bd_pins v_cresample_0/s_axi_aclken] [get_bd_pins v_osd_1/aclken] \
  [get_bd_pins v_osd_1/s_axi_aclken] [get_bd_pins v_rgb2ycrcb_0/aclken] [get_bd_pins v_rgb2ycrcb_0/s_axi_aclken]
connect_bd_net [get_bd_pins v_osd_1/irq] [get_bd_pins irq]
connect_bd_net [get_bd_pins v_axi4s_vid_out_1/vid_data] [get_bd_pins slice_15_8/Din] [get_bd_pins slice_7_0/Din]
connect_bd_net -net s_axi_aclk1_1 [get_bd_pins s_axi_aclk1] [get_bd_pins v_tc_1/s_axi_aclk]
connect_bd_net -net clk1_1 [get_bd_pins clk1] [get_bd_pins v_tc_1/clk]
connect_bd_net [get_bd_pins v_axi4s_vid_out_1/vtg_ce] [get_bd_pins v_tc_1/gen_clken]
connect_bd_net [get_bd_pins v_tc_1/irq] [get_bd_pins irq1]
connect_bd_net [get_bd_pins s_axi_aclken] [get_bd_pins v_tc_1/s_axi_aclken]
connect_bd_net [get_bd_pins clken] [get_bd_pins v_tc_1/clken]
connect_bd_net [get_bd_pins s_axi_aresetn] [get_bd_pins v_tc_1/s_axi_aresetn]
connect_bd_net [get_bd_pins resetn] [get_bd_pins v_tc_1/resetn]
connect_bd_net [get_bd_pins slice_7_0/Dout] [get_bd_pins hdmi_interface_0/CrCb_i]
connect_bd_net -net gnd_const [get_bd_pins gnd/dout] [get_bd_pins hdmi_interface_0/hdmi_ext_int]

current_bd_instance /memory_subsystem
connect_bd_intf_net [get_bd_intf_pins DDR3] [get_bd_intf_pins mig_1/DDR3]
connect_bd_intf_net [get_bd_intf_pins M00_AXI] [get_bd_intf_pins axi_interconnect_2/M00_AXI]
connect_bd_intf_net -intf_net axi_interconnect_2_M00_AXI1 [get_bd_intf_pins S_AXI] [get_bd_intf_pins mig_1/S_AXI]
connect_bd_intf_net -intf_net proc_M_AXI_DC [get_bd_intf_pins S00_AXI] [get_bd_intf_pins axi_interconnect_2/S00_AXI]
connect_bd_intf_net -intf_net proc_M_AXI_IC [get_bd_intf_pins S01_AXI] [get_bd_intf_pins axi_interconnect_2/S01_AXI]
connect_bd_intf_net -intf_net data_M_AXI_MM2S [get_bd_intf_pins S02_AXI] [get_bd_intf_pins axi_interconnect_2/S02_AXI]
connect_bd_intf_net -intf_net data_M_AXI_S2MM [get_bd_intf_pins S03_AXI] [get_bd_intf_pins axi_interconnect_2/S03_AXI]
connect_bd_net -net proc_sys_reset_1_interconnect_aresetn [get_bd_pins M00_ARESETN] \
  [get_bd_pins axi_interconnect_2/ARESETN] [get_bd_pins axi_interconnect_2/S00_ARESETN] \
  [get_bd_pins axi_interconnect_2/M00_ARESETN] [get_bd_pins axi_interconnect_2/S01_ARESETN]
connect_bd_net -net proc_sys_reset_1_peripheral_aresetn [get_bd_pins S02_ARESETN] \
  [get_bd_pins axi_interconnect_2/S02_ARESETN] [get_bd_pins axi_interconnect_2/S03_ARESETN] [get_bd_pins mig_1/aresetn]
connect_bd_net [get_bd_pins mig_1/ui_clk] \
  [get_bd_pins S00_ACLK] [get_bd_pins axi_interconnect_2/S00_ACLK] [get_bd_pins axi_interconnect_2/M00_ACLK] \
  [get_bd_pins axi_interconnect_2/S01_ACLK]
connect_bd_net -net clk_wiz_1_clk_out2 [get_bd_pins S02_ACLK] \
  [get_bd_pins axi_interconnect_2/ACLK] [get_bd_pins axi_interconnect_2/S02_ACLK] [get_bd_pins axi_interconnect_2/S03_ACLK]
connect_bd_net [get_bd_pins sys_rst] [get_bd_pins mig_1/sys_rst]
connect_bd_net -net ext_reset_in_1 [get_bd_pins mig_1/ui_clk_sync_rst] [get_bd_pins ui_clk_sync_rst]
connect_bd_net -net CLK_IN1_P_1 [get_bd_pins sys_clk_p] [get_bd_pins mig_1/sys_clk_p]
connect_bd_net -net CLK_IN1_N_1 [get_bd_pins sys_clk_n] [get_bd_pins mig_1/sys_clk_n]

current_bd_instance /
connect_bd_intf_net -intf_net data_M_AXI_S2MM [get_bd_intf_pins video_pipeline/M_AXI_S2MM] [get_bd_intf_pins memory_subsystem/S03_AXI]
connect_bd_intf_net -intf_net data_M_AXI_MM2S [get_bd_intf_pins video_pipeline/M_AXI_MM2S] [get_bd_intf_pins memory_subsystem/S02_AXI]
connect_bd_intf_net -intf_net proc_M_AXI_IC [get_bd_intf_pins processor_subsystem/M_AXI_IC] [get_bd_intf_pins memory_subsystem/S01_AXI]
connect_bd_intf_net -intf_net proc_M_AXI_DC [get_bd_intf_pins processor_subsystem/M_AXI_DC] [get_bd_intf_pins memory_subsystem/S00_AXI]
connect_bd_intf_net [get_bd_intf_pins video_pipeline/ctrl] [get_bd_intf_pins processor_subsystem/M04_AXI]
connect_bd_intf_net [get_bd_intf_pins video_pipeline/S_AXI_LITE] [get_bd_intf_pins processor_subsystem/M05_AXI]
connect_bd_intf_net -intf_net ctrl1_1 [get_bd_intf_pins video_pipeline/ctrl1] [get_bd_intf_pins processor_subsystem/M06_AXI]
connect_bd_intf_net -intf_net ctrl2_1 [get_bd_intf_pins video_pipeline/ctrl2] [get_bd_intf_pins processor_subsystem/M11_AXI]
connect_bd_intf_net -intf_net ctrl3_1 [get_bd_intf_pins video_pipeline/ctrl3] [get_bd_intf_pins processor_subsystem/M10_AXI]
connect_bd_intf_net -intf_net ctrl4_1 [get_bd_intf_pins video_pipeline/ctrl4] [get_bd_intf_pins processor_subsystem/M07_AXI]
connect_bd_intf_net [get_bd_intf_pins axi_perf_mon_0/S_AXI] [get_bd_intf_pins processor_subsystem/M09_AXI]
connect_bd_intf_net -intf_net axi_interconnect_2_M00_AXI [get_bd_intf_pins memory_subsystem/M00_AXI] [get_bd_intf_pins memory_subsystem/S_AXI]
connect_bd_intf_net [get_bd_intf_pins memory_subsystem/M00_AXI] [get_bd_intf_pins axi_perf_mon_0/SLOT_0_AXI]
connect_bd_intf_net -intf_net mig_1_DDR3 [get_bd_intf_ports DDR3] [get_bd_intf_pins memory_subsystem/DDR3]
connect_bd_intf_net -intf_net proc_IIC [get_bd_intf_ports IIC_MAIN] [get_bd_intf_pins processor_subsystem/IIC]
connect_bd_intf_net -intf_net proc_UART [get_bd_intf_ports uart] [get_bd_intf_pins processor_subsystem/UART]
connect_bd_net -net clk_wiz_1_clk_out2 [get_bd_pins processor_subsystem/clk_out2] \
  [get_bd_pins video_pipeline/m_axi_s2mm_aclk] [get_bd_pins memory_subsystem/S02_ACLK]
connect_bd_net -net hdmi_interface_0_hdmi_clk [get_bd_pins video_pipeline/hdmi_clk] [get_bd_ports ext_hdmi_clk]
connect_bd_net -net hdmi_interface_0_hdmi_data [get_bd_pins video_pipeline/hdmi_data] [get_bd_ports ext_hdmi_data]
connect_bd_net -net hdmi_interface_0_hdmi_de [get_bd_pins video_pipeline/hdmi_de] [get_bd_ports ext_hdmi_de]
connect_bd_net -net hdmi_interface_0_hdmi_hsync [get_bd_pins video_pipeline/hdmi_hsync] [get_bd_ports ext_hdmi_hsync]
connect_bd_net -net hdmi_interface_0_hdmi_vsync [get_bd_pins video_pipeline/hdmi_vsync] [get_bd_ports ext_hdmi_vsync]
connect_bd_net -net mig_1_ui_clk [get_bd_pins processor_subsystem/clk_out1] \
  [get_bd_pins processor_subsystem/slowest_sync_clk] [get_bd_pins processor_subsystem/s_axi_aclk] \
  [get_bd_pins video_pipeline/s_axi_lite_aclk] [get_bd_pins processor_subsystem/s_axi_aclk1] \
  [get_bd_pins processor_subsystem/processor_clk] [get_bd_pins axi_perf_mon_0/s_axi_aclk]
connect_bd_net -net mig_1_ui_clk1 [get_bd_pins memory_subsystem/S00_ACLK] \
  [get_bd_pins processor_subsystem/LMB_Clk] [get_bd_pins processor_subsystem/S00_ACLK] \
  [get_bd_pins processor_subsystem/clk_in1] [get_bd_pins axi_perf_mon_0/slot_0_axi_aclk] \
  [get_bd_pins axi_perf_mon_0/core_aclk]
connect_bd_net -net proc_sys_reset_1_interconnect_aresetn [get_bd_pins processor_subsystem/interconnect_aresetn] \
  [get_bd_pins memory_subsystem/M00_ARESETN]
connect_bd_net -net proc_sys_reset_1_peripheral_aresetn [get_bd_pins processor_subsystem/peripheral_aresetn] \
  [get_bd_pins video_pipeline/axi_resetn] [get_bd_pins memory_subsystem/S02_ARESETN] \
  [get_bd_pins axi_perf_mon_0/s_axi_aresetn] [get_bd_pins axi_perf_mon_0/slot_0_axi_aresetn] \
  [get_bd_pins axi_perf_mon_0/core_aresetn]
connect_bd_net [get_bd_ports EXT_USR_CLK_N] [get_bd_pins video_pipeline/IBUF_DS_N]
connect_bd_net [get_bd_ports EXT_USR_CLK_P] [get_bd_pins video_pipeline/IBUF_DS_P]
connect_bd_net [get_bd_ports CLK_IN1_N] [get_bd_pins memory_subsystem/sys_clk_n]
connect_bd_net [get_bd_ports CLK_IN1_P] [get_bd_pins memory_subsystem/sys_clk_p]
connect_bd_net [get_bd_ports sys_rst] [get_bd_pins memory_subsystem/sys_rst]
connect_bd_net -net ext_reset_in_1 [get_bd_pins memory_subsystem/ui_clk_sync_rst] \
  [get_bd_pins processor_subsystem/ext_reset_in] [get_bd_pins processor_subsystem/reset]
connect_bd_net -net data_irq [get_bd_pins video_pipeline/irq] [get_bd_pins processor_subsystem/In4]
connect_bd_net -net data_irq1 [get_bd_pins video_pipeline/irq1] [get_bd_pins processor_subsystem/In1]

# ---- address map ----
assign_bd_address -offset 0x00000000 -range 128K -target_address_space [get_bd_addr_spaces processor_subsystem/microblaze_1/Data] [get_bd_addr_segs processor_subsystem/lmb_bram_if_cntlr_1/SLMB/Mem]
assign_bd_address -offset 0x40600000 -range 64K -target_address_space [get_bd_addr_spaces processor_subsystem/microblaze_1/Data] [get_bd_addr_segs processor_subsystem/axi_uartlite_1/S_AXI/Reg]
assign_bd_address -offset 0x40800000 -range 64K -target_address_space [get_bd_addr_spaces processor_subsystem/microblaze_1/Data] [get_bd_addr_segs processor_subsystem/interconnect/axi_iic_1/S_AXI/Reg]
assign_bd_address -offset 0x41200000 -range 64K -target_address_space [get_bd_addr_spaces processor_subsystem/microblaze_1/Data] [get_bd_addr_segs processor_subsystem/interconnect/axi_intc_1/s_axi/Reg]
assign_bd_address -offset 0x41400000 -range 4K -target_address_space [get_bd_addr_spaces processor_subsystem/microblaze_1/Data] [get_bd_addr_segs processor_subsystem/mdm_1/S_AXI/Reg]
assign_bd_address -offset 0x41C00000 -range 64K -target_address_space [get_bd_addr_spaces processor_subsystem/microblaze_1/Data] [get_bd_addr_segs processor_subsystem/interconnect/axi_timer_1/S_AXI/Reg]
assign_bd_address -offset 0x44A00000 -range 64K -target_address_space [get_bd_addr_spaces processor_subsystem/microblaze_1/Data] [get_bd_addr_segs video_pipeline/v_tpg_1/ctrl/Reg]
assign_bd_address -offset 0x44A10000 -range 64K -target_address_space [get_bd_addr_spaces processor_subsystem/microblaze_1/Data] [get_bd_addr_segs video_pipeline/axi_vdma_1/S_AXI_LITE/Reg]
assign_bd_address -offset 0x44A20000 -range 64K -target_address_space [get_bd_addr_spaces processor_subsystem/microblaze_1/Data] [get_bd_addr_segs video_pipeline/video_out/v_osd_1/ctrl/Reg]
assign_bd_address -offset 0x44A30000 -range 64K -target_address_space [get_bd_addr_spaces processor_subsystem/microblaze_1/Data] [get_bd_addr_segs video_pipeline/video_out/v_tc_1/ctrl/Reg]
assign_bd_address -offset 0x44A40000 -range 64K -target_address_space [get_bd_addr_spaces processor_subsystem/microblaze_1/Data] [get_bd_addr_segs video_pipeline/video_out/v_rgb2ycrcb_0/ctrl/Reg]
assign_bd_address -offset 0x44A50000 -range 64K -target_address_space [get_bd_addr_spaces processor_subsystem/microblaze_1/Data] [get_bd_addr_segs axi_perf_mon_0/S_AXI/Reg]
assign_bd_address -offset 0x44A60000 -range 64K -target_address_space [get_bd_addr_spaces processor_subsystem/microblaze_1/Data] [get_bd_addr_segs video_pipeline/video_out/v_cresample_0/ctrl/Reg]
assign_bd_address -offset 0x80000000 -range 1G -target_address_space [get_bd_addr_spaces processor_subsystem/microblaze_1/Data] [get_bd_addr_segs memory_subsystem/mig_1/memmap/memaddr]
assign_bd_address -offset 0x00000000 -range 128K -target_address_space [get_bd_addr_spaces processor_subsystem/microblaze_1/Instruction] [get_bd_addr_segs processor_subsystem/lmb_bram_if_cntlr_2/SLMB/Mem]
assign_bd_address -offset 0x80000000 -range 1G -target_address_space [get_bd_addr_spaces processor_subsystem/microblaze_1/Instruction] [get_bd_addr_segs memory_subsystem/mig_1/memmap/memaddr]
assign_bd_address -offset 0x80000000 -range 1G -target_address_space [get_bd_addr_spaces video_pipeline/axi_vdma_1/Data_MM2S] [get_bd_addr_segs memory_subsystem/mig_1/memmap/memaddr]
assign_bd_address -offset 0x80000000 -range 1G -target_address_space [get_bd_addr_spaces video_pipeline/axi_vdma_1/Data_S2MM] [get_bd_addr_segs memory_subsystem/mig_1/memmap/memaddr]

validate_bd_design
save_bd_design
